# EAGLE design mbed-xbee-gyro-srf (EAGLE 5.08)
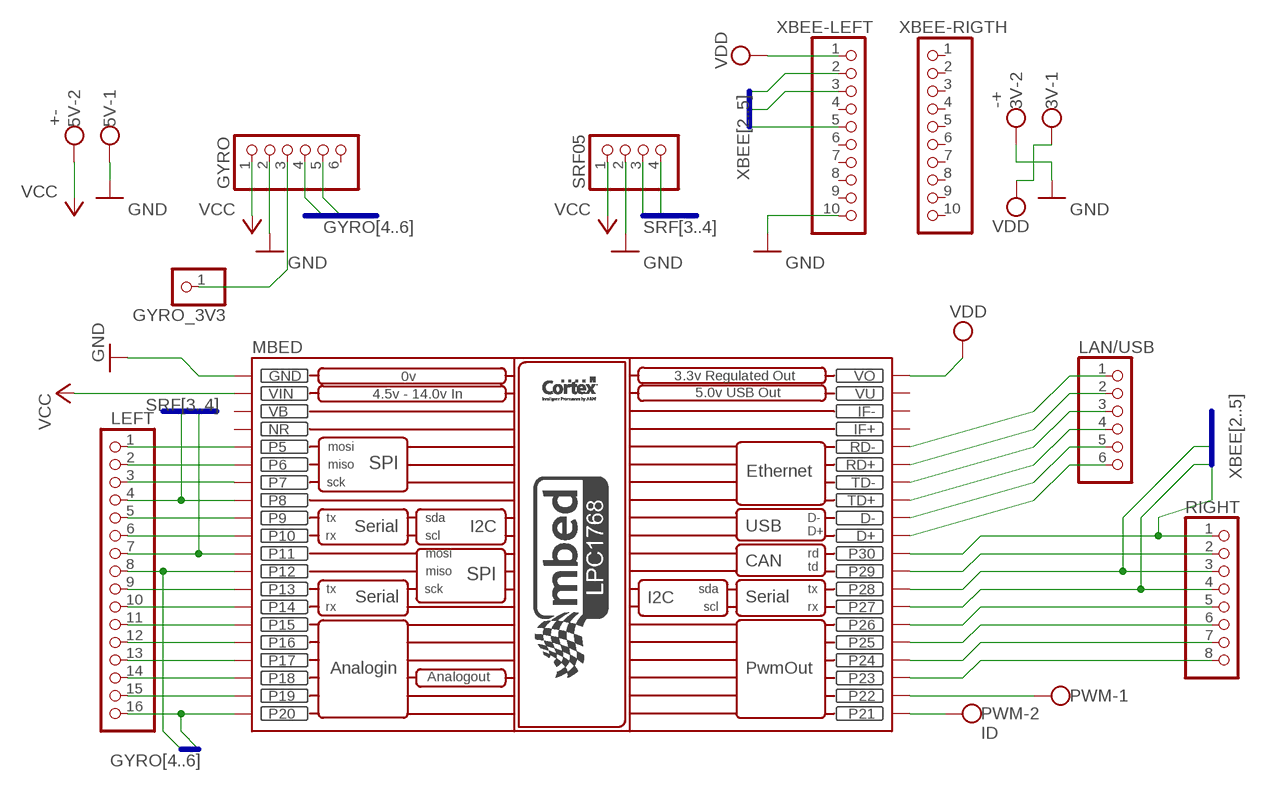
[diagram p0: schematic, sheet 1]

## Parts
3V  -+  W237-02P  [W237-132]
5V  +-  W237-02P  [W237-132]
GYRO  PINHD-1X6  [1X06]
GYRO_3V3  PINHD-1X1  [1X01]
LAN/USB  PINHD-1X6  [1X06]
LEFT  PINHD-1X16  [1X16]
MBED  MBED_NXP_LPC1768  [MBED-KIT]
PWM  ID  W237-02P  [W237-132]
RIGHT  PINHD-1X8  [1X08]
SRF05  PINHD-1X4  [1X04]
XBEE-LEFT  PINHD-1X10  [1X10]
XBEE-RIGTH  PINHD-1X10  [1X10]

## Nets
GND: 3V.2 5V.1 GYRO.2 MBED.GND SRF05.2 XBEE-LEFT.10
GYRO4: GYRO.4 LEFT.16 MBED.P$20(P20)
GYRO5: GYRO.5 LEFT.8 MBED.P$12(P12)
N$1: MBED.P$21(P21) PWM.2
N$2: MBED.P$22(P22) PWM.1
N$3: LEFT.10 MBED.P$14(P14)
N$4: LEFT.15 MBED.P$19(P19)
N$5: LEFT.14 MBED.P$18(P18)
N$6: LEFT.13 MBED.P$17(P17)
N$7: LEFT.12 MBED.P$16(P16)
N$8: LEFT.11 MBED.P$15(P15)
N$9: LEFT.9 MBED.P$13(P13)
N$13: LEFT.6 MBED.P$10(P10)
N$14: LEFT.5 MBED.P$9(P9)
N$16: LEFT.3 MBED.P$7(P7)
N$17: LEFT.2 MBED.P$6(P6)
N$18: LEFT.1 MBED.P$5(P5)
N$19: MBED.P$23(P23) RIGHT.8
N$20: MBED.P$24(P24) RIGHT.7
N$21: MBED.P$25(P25) RIGHT.6
N$22: MBED.P$26(P26) RIGHT.5
N$25: MBED.P$29(P29) RIGHT.2
N$27: LAN/USB.1 MBED.RD-
N$28: LAN/USB.2 MBED.RD+
N$29: LAN/USB.3 MBED.TD-
N$30: LAN/USB.4 MBED.TD+
N$31: LAN/USB.5 MBED.D-
N$32: LAN/USB.6 MBED.D+
N$33: GYRO.3 GYRO_3V3.1
SRF3: LEFT.4 MBED.P$8(P8) SRF05.3
SRF4: LEFT.7 MBED.P$11(P11) SRF05.4
VCC: 5V.2 GYRO.1 MBED.VIN SRF05.1
VDD: 3V.1 MBED.VOUT(VO) XBEE-LEFT.1
XBEE2: MBED.P$27(P27) RIGHT.4 XBEE-LEFT.2
XBEE3: MBED.P$28(P28) RIGHT.3 XBEE-LEFT.3
XBEE5: MBED.P$30(P30) RIGHT.1 XBEE-LEFT.5
Unconnected: GYRO.6 MBED.IF+ MBED.IF- XBEE-LEFT.4 XBEE-LEFT.6 XBEE-LEFT.7 XBEE-LEFT.8 XBEE-LEFT.9 XBEE-RIGTH.1 XBEE-RIGTH.2 XBEE-RIGTH.3 XBEE-RIGTH.4 XBEE-RIGTH.5 XBEE-RIGTH.6 XBEE-RIGTH.7 XBEE-RIGTH.8 XBEE-RIGTH.9 XBEE-RIGTH.10

## Buses
GYRO[4..6]
SRF[3..4]
XBEE[2..5]

## Power pins joined to a net without a drawn wire
NR: MBED.NR
VB: MBED.VB
VU: MBED.VU

## Library data of the parts
3V 5V PWM = con-wago-508:W237-02P: WAGO SREW CLAMP
GYRO LAN/USB = pinhead:PINHD-1X6: PIN HEADER
GYRO_3V3 = pinhead:PINHD-1X1: PIN HEADER
LEFT = pinhead:PINHD-1X16: PIN HEADER
MBED = MBED_v2.1:MBED_NXP_LPC1768: Mbed LPC1768 - ARM CORTEX v2.1 * Schematic symbol is now placed in eagles's default raster. *The pads diameter are suitable for routing between mbed pins * mbed pads are 0.8 mm drill diameter. --------------------------------------------- Created by: Mohamed Yousry *Alexandria, Egypt *Email: mohamed.yousry@ieeegoldegypt.org
RIGHT = pinhead:PINHD-1X8: PIN HEADER
SRF05 = pinhead:PINHD-1X4: PIN HEADER
XBEE-LEFT XBEE-RIGTH = pinhead:PINHD-1X10: PIN HEADER

## Board
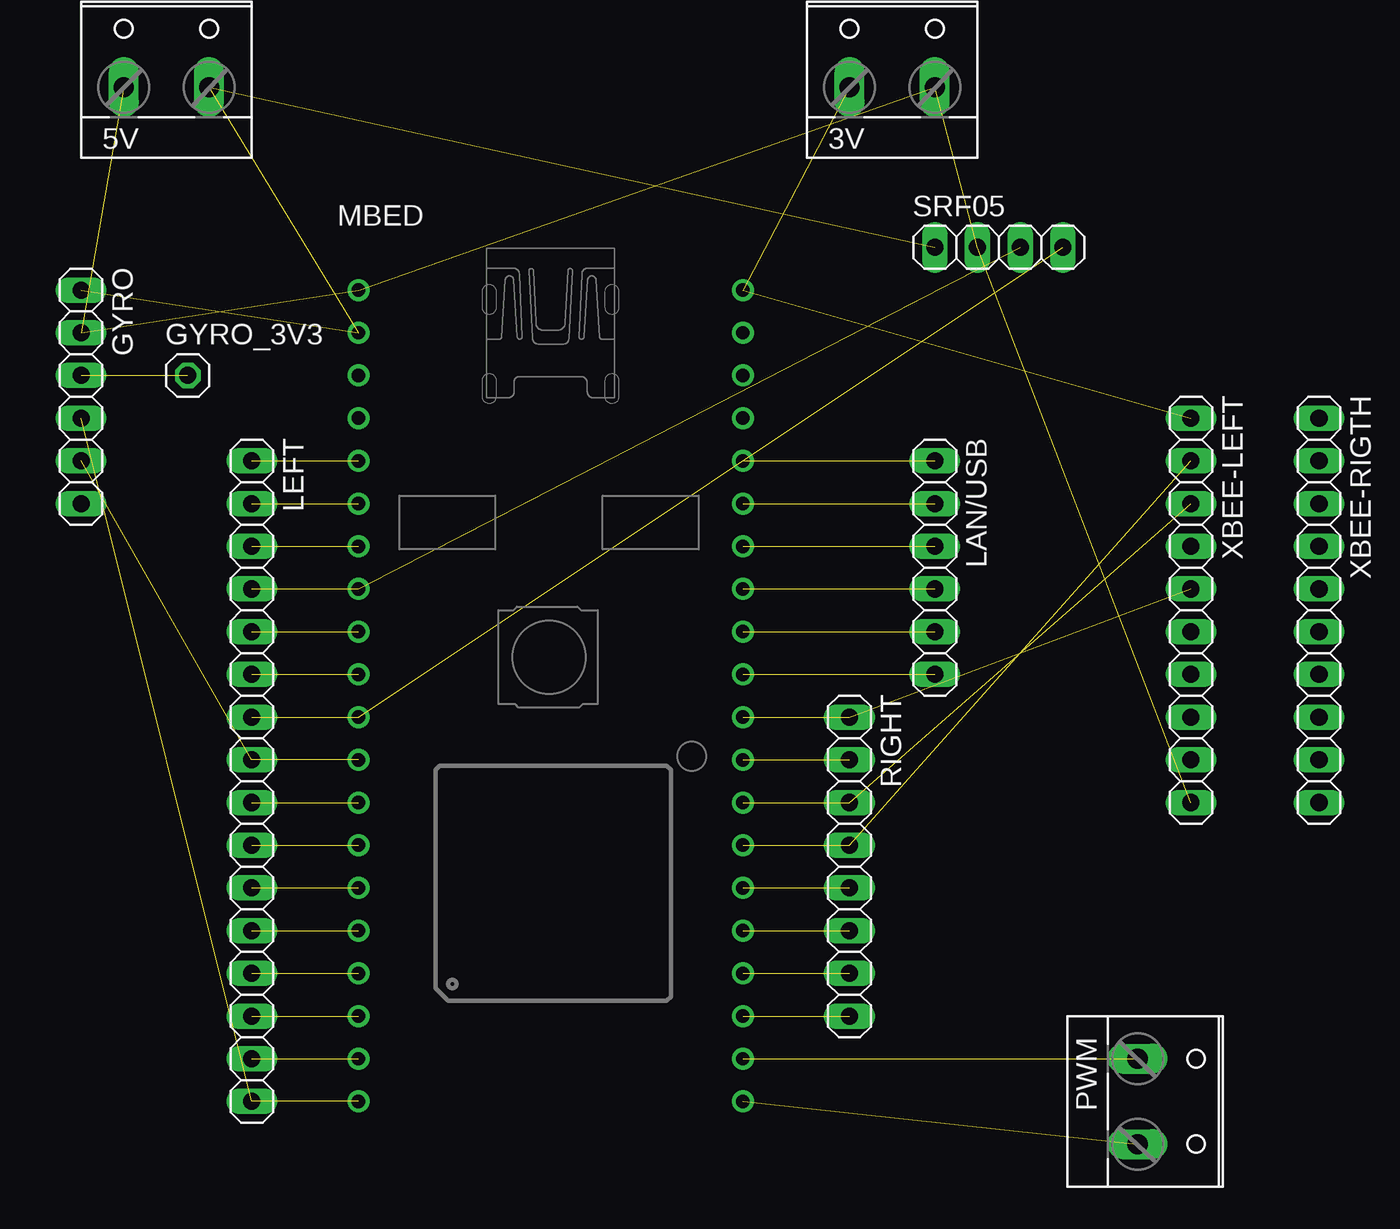
[diagram p1: board, top side]
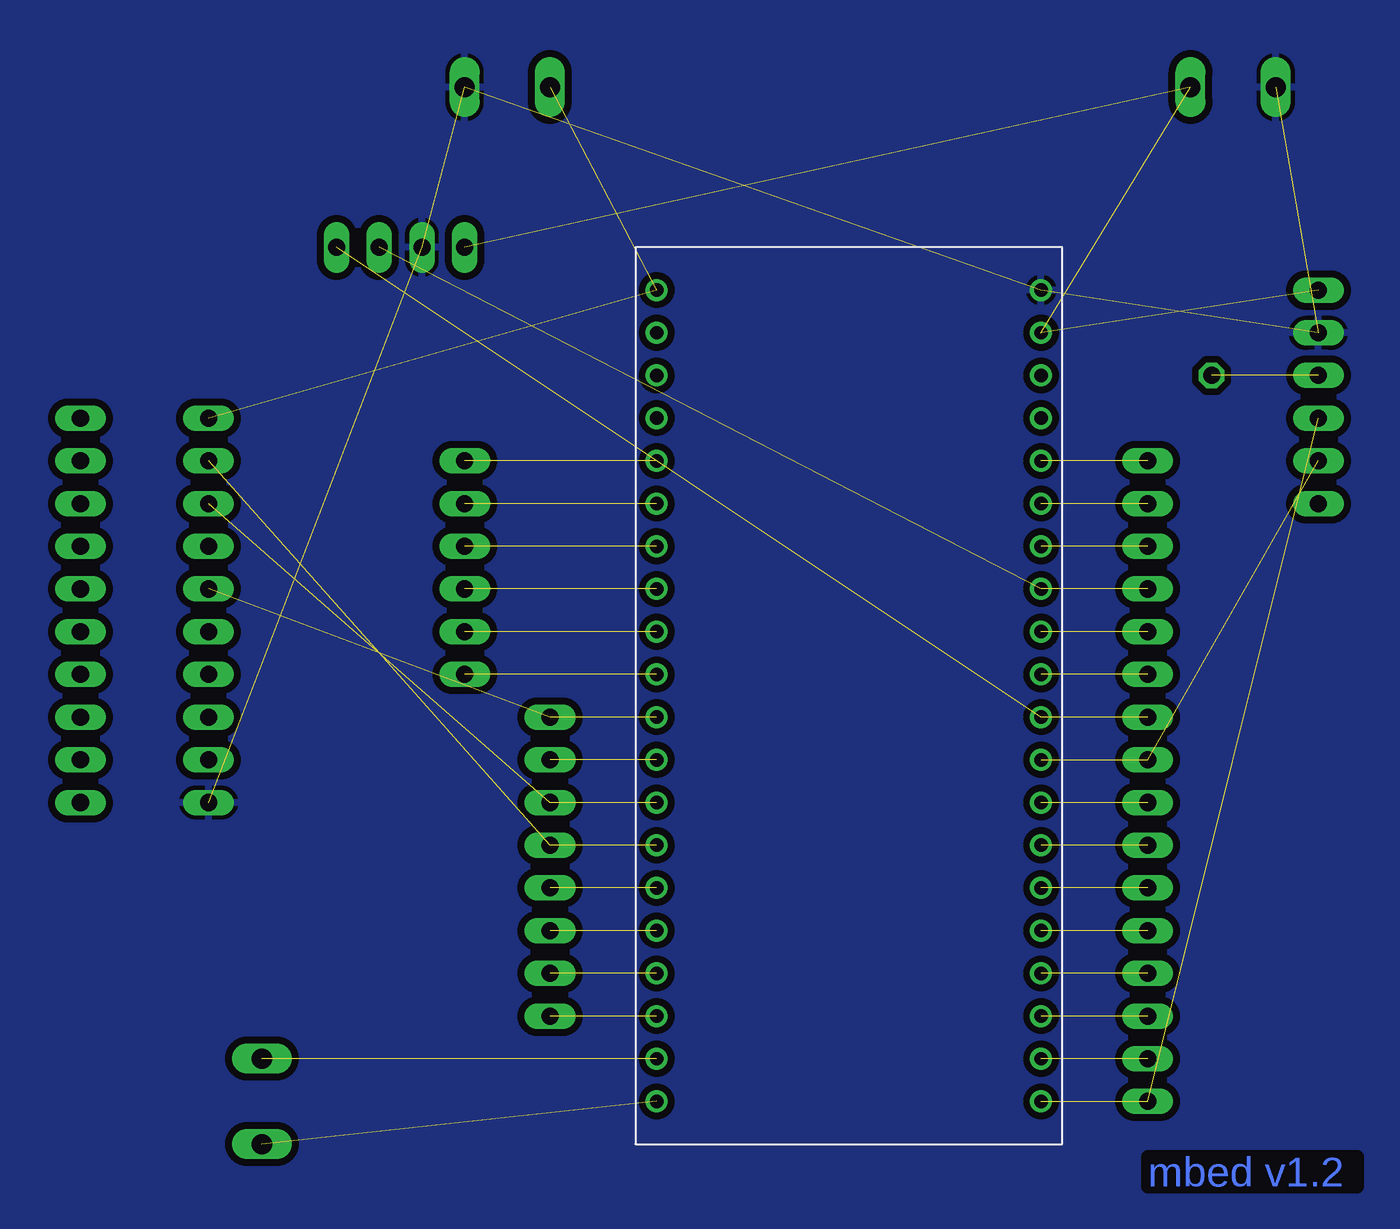
[diagram p2: board, bottom side, seen from below]

No outline drawn. Coordinates in mm, seen from the top.
Copper layers (1*16): Top 0.035mm / dielectric 1.5mm / Bottom 0.035mm
Design rules "default *": minimum track width 16mil, minimum drill 24mil, track to track 16mil, track to pad 16mil, pad to pad 16mil, via to via 16mil, smd to smd 8mil, copper to edge 40mil, drill to drill 8mil, minimum pad ring 10mil, minimum via ring 8mil, stop-mask expansion 4mil, vias tented up to drill 0mil, thermal gap 10mil

### Footprints (pad centres in the part's own frame; a part is rotated, then mirrored left to right if it is on the bottom)
W237-132 = drill 1.194 long: 1 -2.54,-0.635; 2 2.54,-0.635
1X06 = drill 1.016 long: 1 -6.35,0; 2 -3.81,0; 3 -1.27,0; 4 1.27,0; 5 3.81,0; 6 6.35,0
1X01 = drill 1.016 octagon: 1 0,0
1X16 = drill 1.016 long: 1 -19.05,0; 2 -16.51,0; 3 -13.97,0; 4 -11.43,0; 5 -8.89,0; 6 -6.35,0; 7 -3.81,0; 8 -1.27,0; 9 1.27,0; 10 3.81,0; 11 6.35,0; 12 8.89,0; 13 11.43,0; 14 13.97,0; 15 16.51,0; 16 19.05,0
MBED-KIT = drill 0.8 round: D+ 11.43,1.27; D- 11.43,3.81; GND -11.43,24.13; IF+ 11.43,16.51; IF- 11.43,19.05; NR -11.43,16.51; P$5 -11.43,13.97; P$6 -11.43,11.43; P$7 -11.43,8.89; P$8 -11.43,6.35; P$9 -11.43,3.81; P$10 -11.43,1.27; P$11 -11.43,-1.27; P$12 -11.43,-3.81; P$13 -11.43,-6.35; P$14 -11.43,-8.89; P$15 -11.43,-11.43; P$16 -11.43,-13.97; P$17 -11.43,-16.51; P$18 -11.43,-19.05; P$19 -11.43,-21.59; P$20 -11.43,-24.13; P$21 11.43,-24.13; P$22 11.43,-21.59; P$23 11.43,-19.05; P$24 11.43,-16.51; P$25 11.43,-13.97; P$26 11.43,-11.43; P$27 11.43,-8.89; P$28 11.43,-6.35; P$29 11.43,-3.81; P$30 11.43,-1.27; RD+ 11.43,11.43; RD- 11.43,13.97; TD+ 11.43,6.35; TD- 11.43,8.89; VB -11.43,19.05; VIN -11.43,21.59; VOUT 11.43,24.13; VU 11.43,21.59
1X08 = drill 1.016 long: 1 -8.89,0; 2 -6.35,0; 3 -3.81,0; 4 -1.27,0; 5 1.27,0; 6 3.81,0; 7 6.35,0; 8 8.89,0
1X04 = drill 1.016 long: 1 -3.81,0; 2 -1.27,0; 3 1.27,0; 4 3.81,0
1X10 = drill 1.016 long: 1 -11.43,0; 2 -8.89,0; 3 -6.35,0; 4 -3.81,0; 5 -1.27,0; 6 1.27,0; 7 3.81,0; 8 6.35,0; 9 8.89,0; 10 11.43,0

### Placement (x,y rotation side)
3V  60.96,71.12 0 top
5V  17.78,71.12 0 top
GYRO  12.7,52.07 270 top
GYRO_3V3  19.05,53.34 0 top
LAN/USB  63.5,41.91 270 top
LEFT  22.86,29.21 270 top
MBED  40.64,34.29 0 top
PWM  76.2,10.16 270 top
RIGHT  58.42,24.13 270 top
SRF05  67.31,60.96 0 top
XBEE-LEFT  78.74,39.37 270 top
XBEE-RIGTH  86.36,39.37 270 top

### Tracks (layer width: path | path; a pad name or v marks a point on that pad's centre or on a via)
GND  (5 unrouted)
  pour Bottom: 7.62,2.54 91.44,2.54 91.44,76.2 7.62,76.2
GYRO4  (2 unrouted)
GYRO5  (2 unrouted)
N$1  (1 unrouted)
N$2  (1 unrouted)
N$3  (1 unrouted)
N$4  (1 unrouted)
N$5  (1 unrouted)
N$6  (1 unrouted)
N$7  (1 unrouted)
N$8  (1 unrouted)
N$9  (1 unrouted)
N$13  (1 unrouted)
N$14  (1 unrouted)
N$16  (1 unrouted)
N$17  (1 unrouted)
N$18  (1 unrouted)
N$19  (1 unrouted)
N$20  (1 unrouted)
N$21  (1 unrouted)
N$22  (1 unrouted)
N$25  (1 unrouted)
N$27  (1 unrouted)
N$28  (1 unrouted)
N$29  (1 unrouted)
N$30  (1 unrouted)
N$31  (1 unrouted)
N$32  (1 unrouted)
N$33  (1 unrouted)
SRF3  (2 unrouted)
SRF4  (2 unrouted)
VCC  (3 unrouted)
VDD  (2 unrouted)
XBEE2  (2 unrouted)
XBEE3  (2 unrouted)
XBEE5  (2 unrouted)

### Text on the board
Bottom: mbed v1.2